# EAGLE schematic FLONW2WIQIA89IA (EAGLE 7.5.0)
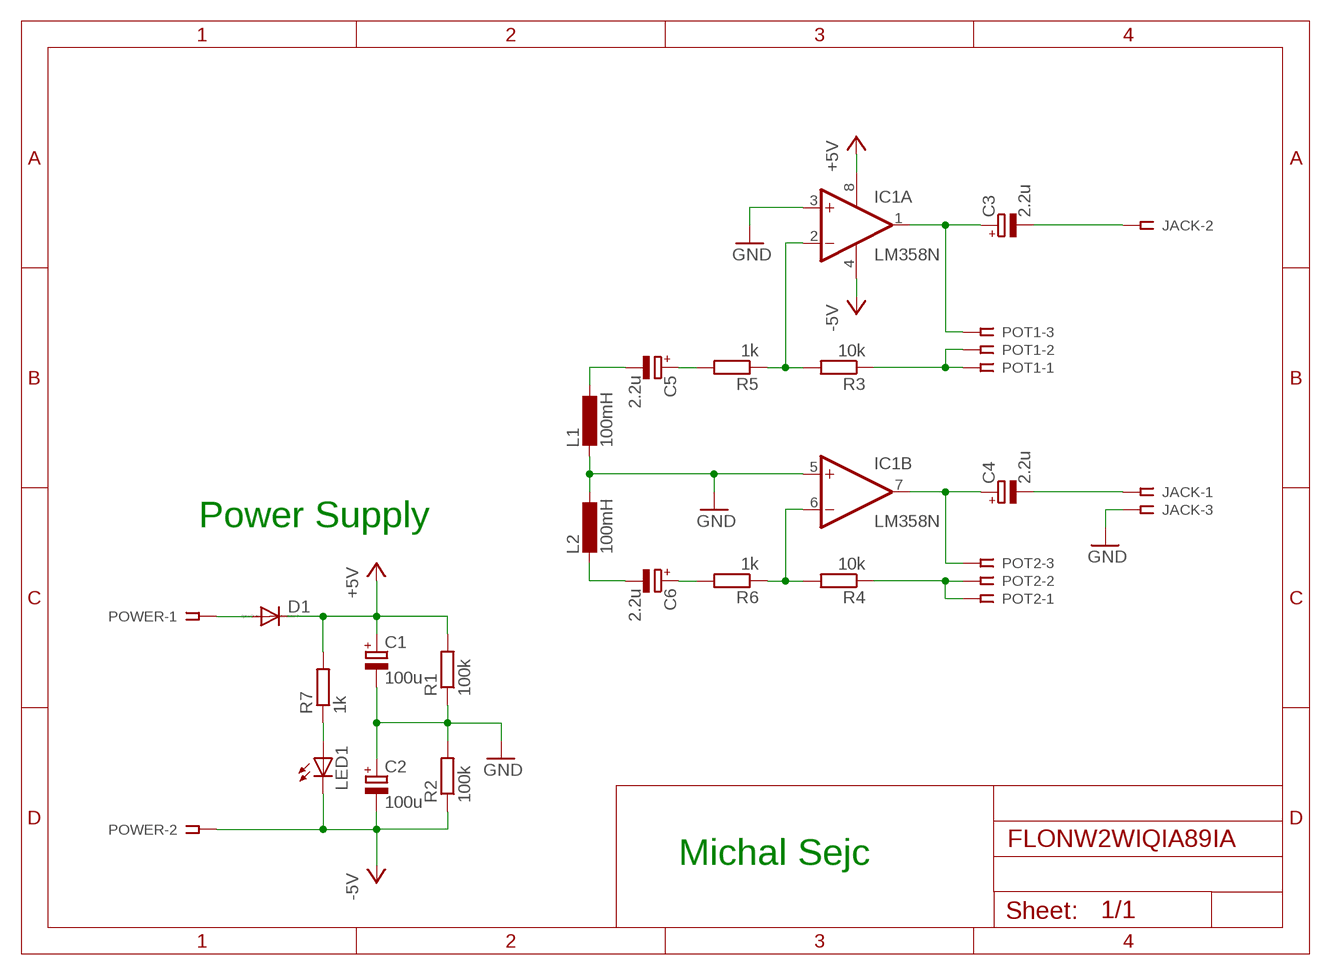
[diagram p0: schematic, sheet 1]

## Parts
C1  100u  CPOL-EUE2.5-7  [E2,5-7]
C2  100u  CPOL-EUE2.5-7  [E2,5-7]
C3  2.2u  CPOL-EUE2,5-6E  [E2,5-6E]
C4  2.2u  CPOL-EUE2,5-6E  [E2,5-6E]
C5  2.2u  CPOL-EUE2,5-6E  [E2,5-6E]
C6  2.2u  CPOL-EUE2,5-6E  [E2,5-6E]
D1  1N4148DO35-7  [DO35-7]
IC1  LM358N  [DIL08]
JACK  SSW-103-02-S-S-RA  [SSW-103-02-S-S-RA]
L1  100mH  L-EU0204/5  [0204/5]
L2  100mH  L-EU0204/5  [0204/5]
LED1  LED5MM  [LED5MM]
POT1  SSW-103-02-S-S-RA  [SSW-103-02-S-S-RA]
POT2  SSW-103-02-S-S-RA  [SSW-103-02-S-S-RA]
POWER  SSW-102-02-S-S-RA  [SSW-102-02-S-S-RA]
R1  100k  R-EU_0204/7  [0204/7]
R2  100k  R-EU_0204/7  [0204/7]
R3  10k  R-EU_0204/7  [0204/7]
R4  10k  R-EU_0204/7  [0204/7]
R5  1k  R-EU_0204/7  [0204/7]
R6  1k  R-EU_0204/7  [0204/7]
R7  1k  R-EU_0204/7  [0204/7]

## Nets
+5V: C1.+ D1.C IC1.8(P:V+) R1.2 R7.2
-5V: C2.- IC1.4(P:V-) LED1.K(C) POWER.2 R2.1
GND: C1.- C2.+ IC1.3(A:+IN) IC1.5(B:+IN) JACK.3 L1.2 L2.1 R1.1 R2.2
N$1: IC1.2(A:-IN) R3.2 R5.1
N$2: C3.+ IC1.1(A:OUT) POT1.3
N$3: C4.+ IC1.7(B:OUT) POT2.3
N$4: POT1.1 POT1.2 R3.1
N$5: IC1.6(B:-IN) R4.2 R6.1
N$6: POT2.1 POT2.2 R4.1
N$7: C5.+ R5.2
N$8: C6.+ R6.2
N$9: D1.A POWER.1
N$10: C3.- JACK.2
N$11: C4.- JACK.1
N$12: C5.- L1.1
N$13: C6.- L2.2
N$14: LED1.A R7.1

## Notes on the sheet
- Power Supply
- Michal Sejc

## Library data of the parts
C1-C6 = rcl:CPOL-EU: POLARIZED CAPACITOR, European symbol
D1 = diode:1N4148: DIODE high speed (Philips)
IC1 = linear:LM358: OP AMP also LM158; LM258; LM2904 Source: http://cache.national.com/ds/LM/LM158.pdf
JACK POT1 POT2 = con-samtec:SSW-103-02-S-S: THROUGH-HOLE .025" SQ POST SOCKET Source: Samtec SSW.pdf; MPN: SSW-103-02-S-S-RA; OC_FARNELL: unknown; OC_NEWARK: 11P9368
L1 L2 = rcl:L-EU: INDUCTOR, European symbol
LED1 = led:LED: LED OSRAM: - CHIPLED LG R971, LG N971, LY N971, LG Q971, LY Q971, LO R971, LY R971 LH N974, LH R974 LS Q976, LO Q976, LY Q976 LO Q996 - Hyper CHIPLED LW Q18S LB Q993, LB Q99A, LB R99A - SideLED LS A670, LO A670, LY A670, LG A670, LP A670 LB A673, LV A673, LT A673, LW A673 LH A674 LY A675 LS A676, LA A676, LO A676, LY A676, LW A676 LS A679, LY A679, LG A679 - Hyper Micro SIDELED® LS Y876, LA Y876, LO Y876, LY Y876 LT Y87S - SmartLED LW L88C, LW L88S LB L89C, LB L89S, LG L890 LS L89K, LO L89K, LY L89K LS L896, LA L896, LO L896, LY L896 - TOPLED LS T670, LO T670, LY T670, LG T670, LP T670 LSG T670, LSP T670, LSY T670, LOP T670, LYG T670 LG T671, LOG T671, LSG T671 LB T673, LV T673, LT T673, LW T673 LH T674 LS T676, LA T676, LO T676, LY T676, LB T676, LH T676, LSB T676, LW T676 LB T67C, LV T67C, LT T67C, LS T67K, LO T67K, LY T67K, LW E67C LS E67B, LA E67B, LO E67B, LY E67B, LB E67C, LV E67C, LT E67C LW T67C LS T679, LY T679, LG T679 LS T770, LO T770, LY T770, LG T770, LP T770 LB T773, LV T773, LT T773, LW T773 LH T774 LS E675, LA E675, LY E675, LS T675 LS T776, LA T776, LO T776, LY T776, LB T776 LHGB T686 LT T68C, LB T68C - Hyper Mini TOPLED® LB M676 - Mini TOPLED Santana® LG M470 LS M47K, LO M47K, LY M47K Source: http://www.osram.convergy.de LUXEON: - LUMILED® LXK2-PW12-R00, LXK2-PW12-S00, LXK2-PW14-U00, LXK2-PW14-V00 LXK2-PM12-R00, LXK2-PM12-S00, LXK2-PM14-U00 LXK2-PE12-Q00, LXK2-PE12-R00, LXK2-PE12-S00, LXK2-PE14-T00, LXK2-PE14-U00 LXK2-PB12-K00, LXK2-PB12-L00, LXK2-PB12-M00, LXK2-PB14-N00, LXK2-PB14-P00, LXK2-PB14-Q00 LXK2-PR12-L00, LXK2-PR12-M00, LXK2-PR14-Q00, LXK2-PR14-R00 LXK2-PD12-Q00, LXK2-PD12-R00, LXK2-PD12-S00 LXK2-PH12-R00, LXK2-PH12-S00 LXK2-PL12-P00, LXK2-PL12-Q00, LXK2-PL12-R00 Source: www.luxeon.com KINGBRIGHT: KA-3528ASYC Source: www.kingbright.com
POWER = con-samtec:SSW-102-02-S-S: THROUGH-HOLE .025" SQ POST SOCKET Source: Samtec SSW.pdf; MPN: SSW-102-02-S-S-RA; OC_FARNELL: unknown; OC_NEWARK: 11P9352
R1-R7 = rcl:R-EU_: RESISTOR, European symbol